# EAGLE schematic Wheel Speed Sensor rev1.1 (EAGLE 9.5.0)
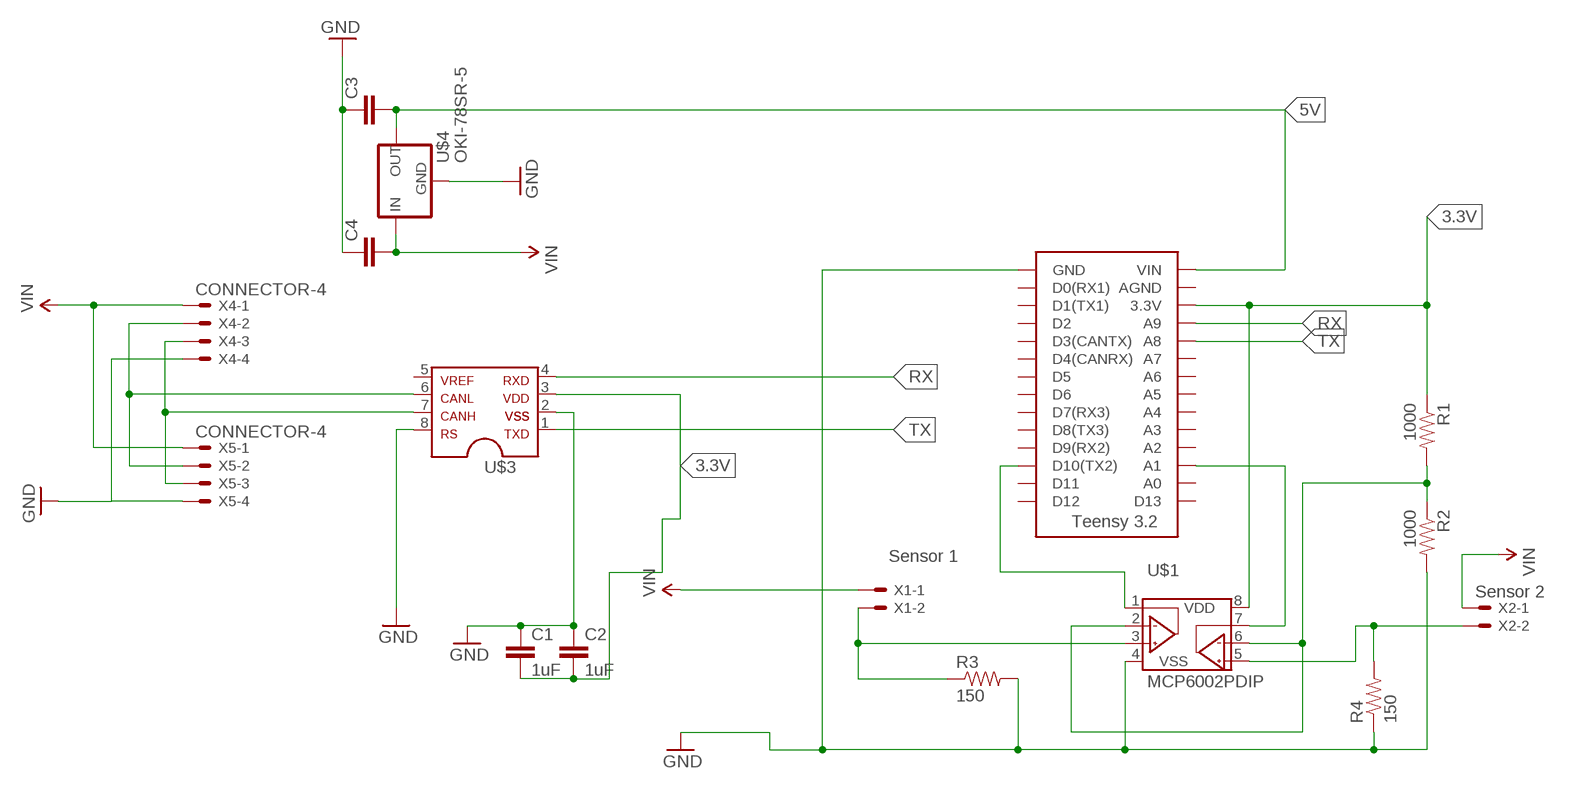
[diagram p0: schematic, sheet 1]

## Parts
C1  1uF  CAPEZ  [CAP-PTH-SMALLEZ]
C2  1uF  CAPEZ  [CAP-PTH-SMALLEZ]
C3  CAPEZ  [CAP-PTH-SMALLEZ]
C4  CAPEZ  [CAP-PTH-SMALLEZ]
R1  1000  RESISTORAXIAL-0.3  [AXIAL-0.3]
R2  1000  RESISTORAXIAL-0.3  [AXIAL-0.3]
R3  150  RESISTORAXIAL-0.3  [AXIAL-0.3]
R4  150  RESISTORAXIAL-0.3  [AXIAL-0.3]
U$1  MCP6002PDIP  [DIL08]
U$2  TEENSY_3.2_SIMPLE  [TEENSY_3.2_SIMPLE]
U$3  MCP2551DIL  [DIL08]
U$4  OKI-78SR-5  [OKI-78SR]
X1  Sensor 1  CONNECTOR-2  [MINIFIT_5566-2]
X2  Sensor 2  CONNECTOR-2  [MINIFIT_5566-2]
X4  CONNECTOR-4  [MINIFIT_5566-4]
X5  CONNECTOR-4  [MINIFIT_5566-4]

## Nets
3.3V: C1.2 C2.2 R1.P$1 U$1.8(VDD) U$2.3.3V U$3.3
5V: C3.2 U$2.VIN U$4.3(OUT)
CANH: U$3.7 X4.3 X5.3
GND: C1.1 C2.1 C3.1 C4.1 R2.P$2 R3.P$2 R4.P$1 U$1.4(VSS) U$2.GND U$3.2 U$3.8 U$4.2(GND) X4.4 X5.4
N$2: R1.P$2 R2.P$1 U$1.2(VINA-) U$1.6(VINB-)
N$3: U$3.6 X4.2 X5.2
N$4: R3.P$1 U$1.3(VINA+) X1.2
N$5: U$1.7(VOUTB) U$2.A1
N$6: U$1.1(VOUTA) U$2.D10(TX2)
N$8: R4.P$2 U$1.5(VINB+) X2.2
RX: U$2.A9 U$3.4
TX: U$2.A8 U$3.1
VIN: C4.2 U$4.1(IN) X1.1 X2.1 X4.1 X5.1
Unconnected: U$2.A0 U$2.A2 U$2.A3 U$2.A4 U$2.A5 U$2.A6 U$2.A7 U$2.AGND U$2.D0(RX1) U$2.D1(TX1) U$2.D2 U$2.D3(CANTX) U$2.D4(CANRX) U$2.D5 U$2.D6 U$2.D7(RX3) U$2.D8(TX3) U$2.D9(RX2) U$2.D11 U$2.D12 U$2.D13 U$3.5

## Library data of the parts
C1-C4 = HyTechDevices:CAP: Capacitor Standard 0603 ceramic capacitor, and 0.1" leaded capacitor.
R1-R4 = HyTechDevices:RESISTOR: Resistor Basic schematic elements and footprints for 0603, 1206, and PTH resistors.
U$1 = HyTechDevices:MCP6002: Microchip MCP6002 Dual Channel Op Amp
U$2 = HyTechDevices:TEENSY_3.2_SIMPLE: Simple version of the Teensy 3.2 board that only uses the 2 main rows of pins, not the inner pins or the pins opposite the usb port.
U$3 = HyTechDevices:MCP2551: MCP2551 High-Speed CAN Transceiver Product Webpage <https://www.microchip.com/wwwproducts/en/MCP2551> Datasheet <http://ww1.microchip.com/downloads/en/DeviceDoc/21667f.pdf> This device is outdated It is replaced by MCP2561. Comparison Page <https://www.microchip.com/wwwproducts/ProductCompare/MCP2551/MCP2561> Product Webpage <https://www.microchip.com/wwwproducts/en/MCP2561> Datasheet <http://ww1.microchip.com/downloads/en/DeviceDoc/20005167C.pdf>
U$4 = HyTechDevices:OKI-78SR-5: Murata OKI-78SR 5V 1.5A Non-Isolated Switching Regulator DC/DC - Datasheet <https://power.murata.com/data/power/oki-78sr.pdf>
X1 X2 = HyTechDevices:CONNECTOR-2: Mini-Fit Junior connector 2 pole Source: http://www.molex.com; OC_FARNELL: 1822072; OC_NEWARK: unknown
X4 X5 = HyTechDevices:CONNECTOR-4: Mini-Fit Junior connector 4 pole Source: http://www.molex.com; OC_FARNELL: unknown; OC_NEWARK: unknown